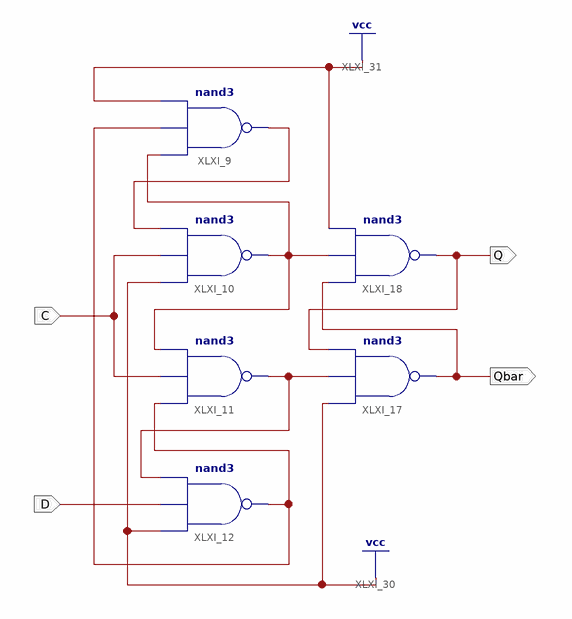
[diagram p0: schematic sheet 1]
// Xilinx ISE schematic D_FlipFlop.sch (kintex7) as structural Verilog: 6 symbols, 4 ports
module D_FlipFlop (
  input  C,
  input  D,
  output Q,
  output Qbar
);

  wire Qbaro, Qo, XLXN_21, XLXN_30;

  nand XLXI_9 (Qo, Qbaro, XLXN_30, 1'b1);
  nand XLXI_10 (Qbaro, 1'b1, C, Qo);
  nand XLXI_11 (XLXN_21, XLXN_30, C, Qbaro);
  nand XLXI_12 (XLXN_30, 1'b1, D, XLXN_21);
  nand XLXI_18 (Q, Qbar, Qbaro, 1'b1);
  nand XLXI_17 (Qbar, 1'b1, XLXN_21, Q);
endmodule
